# Altium schematic sheet power-input.SchDoc
size A4; SheetNumber: 2
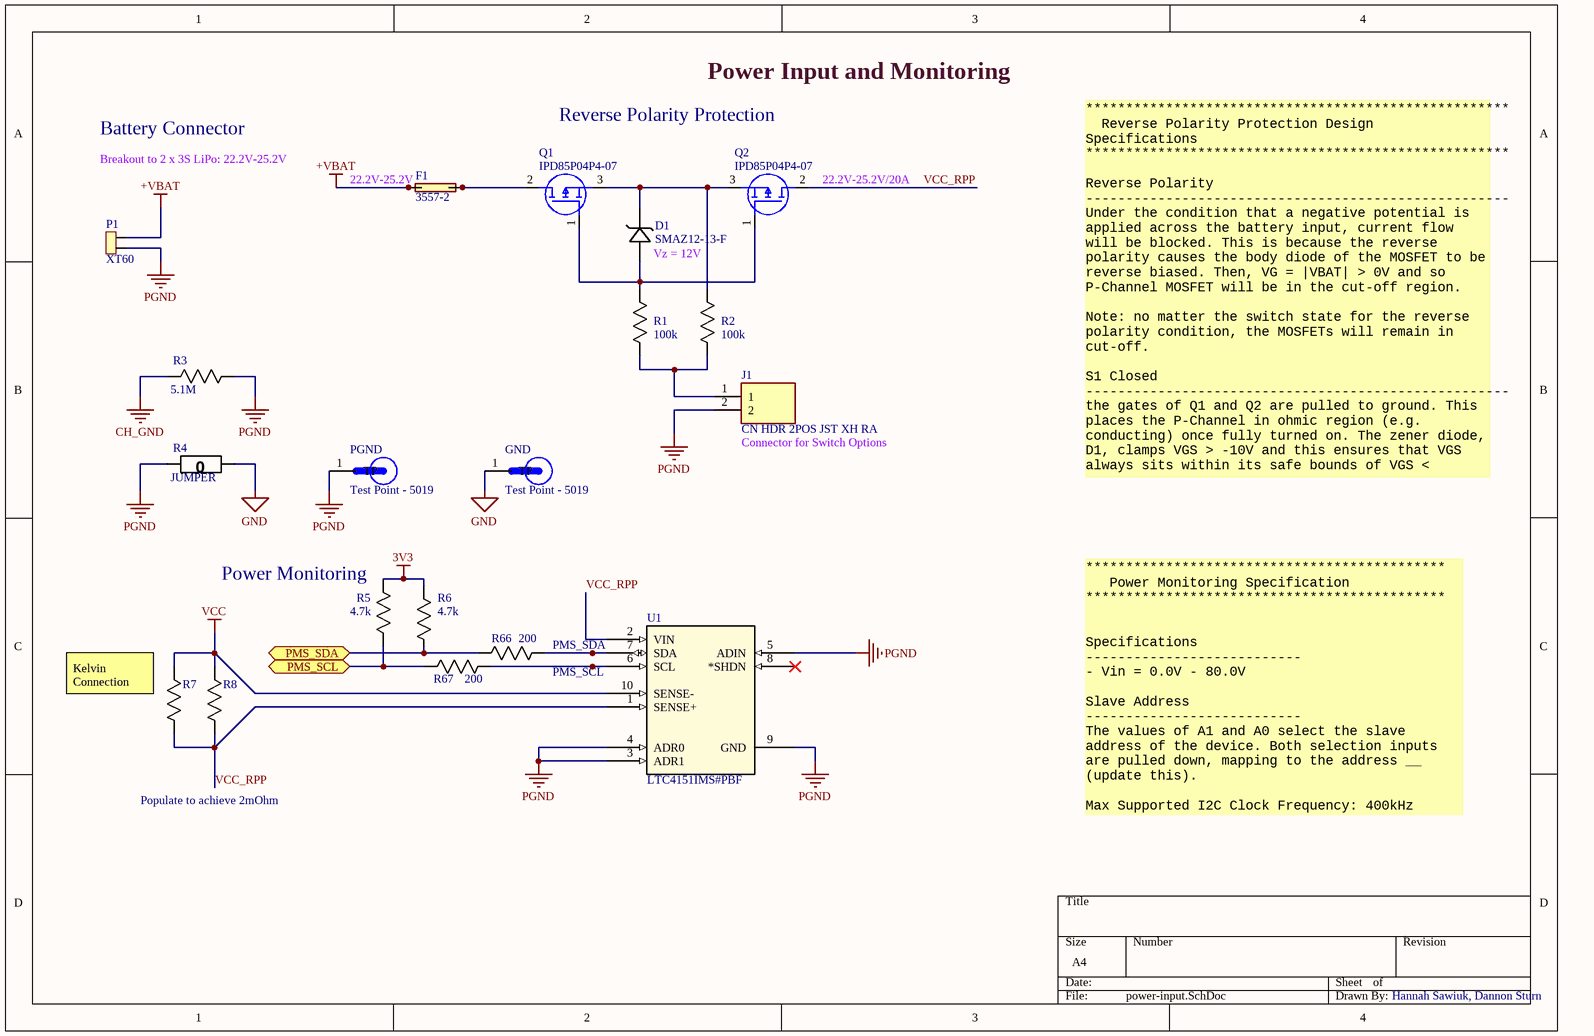
[diagram p0: power-input.SchDoc]

## Parts
D1  SMAZ12-13-F  [SMA_DIO-L]
F1  3557-2  [FUSE-3549-2]
GND  Test Point - 5019  [TP380X203]
J1  CN HDR 2POS JST XH RA  [JST_S2B-XH-A(LF)(SN)]
P1  XT60  [Amass_XT60PW-M]
PGND  Test Point - 5019  [TP380X203]
PMS_SCL  Test Point (Via)  [TP]  (value not drawn)  (no BOM)
PMS_SDA  Test Point (Via)  [TP]  (value not drawn)  (no BOM)
Q1  IPD85P04P4-07  [DPAK (TO-252)]
Q2  IPD85P04P4-07  [DPAK (TO-252)]
R1  100k  [0603]
R2  100k  [0603]
R3  5.1M  [0603]
R4  JUMPER  [1210]
R5  4.7k  [0603]
R6  4.7k  [0603]
R7  2mOHM  [2512]  (value not drawn)
R8  2mOHM  [2512]  (value not drawn)
R66  200  [0603]
R67  200  [0603]
U1  LTC4151IMS#PBF  [MSOP-10_MS_LIT]

## Ports
PMS_SCL (bidir), PMS_SDA (bidir)

## Nets
3V3: R5.2(R2) R6.2(R2)
+VBAT: F1.3(2A) F1.4(2B) P1.2
CH_GND: R3.2(R2)
GND: GND.1(TP) R4.1(R1)
PGND: J1.2 P1.1 PGND.1(TP) R3.1(R1) R4.2(R2) U1.3(ADR1) U1.4(ADR0) U1.5(ADIN) U1.9(GND)
VCC: R7.1(R1) R8.1(R1) U1.10(SENSE-)
PMS_SCL: R5.1(R1) R67.2(R2) ; port PMS_SCL
PMS_SDA: R6.1(R1) R66.2(R2) ; port PMS_SDA
VCC_RPP: Q2.2(D) R7.2(R2) R8.2(R2) U1.1(SENSE+) U1.2(VIN)
NetD1_1: D1.1 Q1.3(S) Q2.3(S) R2.1(R1)
NetD1_2: D1.2 Q1.1(G) Q2.1(G) R1.1(R1)
NetF1_1: F1.1(1A) F1.2(1B) Q1.2(D)
NetJ1_1: J1.1 R1.2(R2) R2.2(R2)
NetPMS_SCL_1: PMS_SCL.1 R67.1(R1) U1.6(SCL)
NetPMS_SDA_1: PMS_SDA.1 R66.1(R1) U1.7(SDA)

Not connected (* = marked no-connect by the designer): U1 8(*SHDN)*

## Notes on the sheet
- Power Input and Monitoring
- Battery Connector
- Breakout to 2 x 3S LiPo: 22.2V-25.2V
- Reverse Polarity Protection
- (near F1) 22.2V-25.2V
- (near Q2) 22.2V-25.2V/20A
- (near D1) Vz = 12V
- (near J1) Connector for Switch Options
- *****************************************************
  Reverse Polarity Protection Design Specifications
  *****************************************************
  Reverse Polarity
  -----------------------------------------------------
  Under the condition that a negative potential is applied across the battery input, current flow will be blocked. This is because the reverse polarity causes the body diode of the MOSFET to be reverse biased. Then, VG = |VBAT| > 0V and so P-Channel MOSFET will be in the cut-off region.
  Note: no matter the switch state for the reverse polarity condition, the MOSFETs will remain in cut-off.
  S1 Closed
  -----------------------------------------------------
  the gates of Q1 and Q2 are pulled to ground. This places the P-Channel in ohmic region (e.g. conducting) once fully turned on. The zener diode, D1, clamps VGS > -10V and this ensures that VGS always sits within its safe bounds of VGS < +5/-16V.
- (near R5) Power Monitoring
- (near R7) Kelvin Connection
- Populate to achieve 2mOhm
- *********************************************
  Power Monitoring Specification
  *********************************************
  Specifications
  ---------------------------
  - Vin = 0.0V - 80.0V
  Slave Address
  ---------------------------
  The values of A1 and A0 select the slave address of the device. Both selection inputs are pulled down, mapping to the address __ (update this).
  Max Supported I2C Clock Frequency: 400kHz
- Hannah Sawiuk, Dannon Sturn

## Library data of the parts
D1 = DIODE ZENER 12V 1W: Zener Diode 12 V 1 W ±5% Surface Mount SMA; Mfr_Name: Diodes Inc; Type: DEV; Copyright: Copyright (C) 2021 Ultra Librarian. All rights reserved.; Manufacturer_Part_Number: SMAZ12-13-F; Digi-Key_Part_Number_1: SMAZ12-FDICT-ND; Digi-Key_Part_Number_2: SMAZ12-FDIDKR-ND; Digi-Key_Part_Number_3: SMAZ12-FDITR-ND; RefDes: RefDes; Supplier 1: Digi-Key; Supplier 2: Newark; Supplier 3: Digi-Key; Supplier Part Number 1: SMAZ12-FDICT-ND; Supplier Part Number 2: 23T8541; Supplier Part Number 3: SMAZ12-FDICT-ND; Part Number: DIODE ZENER 12V 1W; Manufacturer Part Number 1: SMAZ12-13-F; Supplier URL 1: https://www.digikey.com/en/products/detail/SMAZ12-13-F/SMAZ12-FDICT-ND/725073?curr=usd&utm_campaign=buynow&utm_medium=aggregator&utm_source=octopart
F1 = FUSE BLADE: Fuse Block 30A 500V 1 Circuit Blade Through Hole; MF: Keystone Electronics; Package: Nonstandard Keystone; Value: *; Price: None; MP: 3557-2; SnapEDA_Link: https://www.snapeda.com/parts/3557-2/Keystone%20Electronics/view-part/278060/?ref=snap; Supplier 1: Digi-Key; Supplier Part Number 1: 36-3557-2-ND; Part Number: FUSE BLADE; Pin Count: 4
GND PGND = Test Point - 5019: PC Test Point, Miniature Phosphor Bronze, Silver Plating Surface Mount Mounting Type; MP: 5019; MF: Keystone Electronics; Value: *; Package: 2010 Keystone; Part Number: Test Point - 5019
J1 = CN HDR 2POS JST XH RA: Connector Header Through Hole 2 position right angle 0.098 _2.50mm_ / JST XH; MP: B2B-XH-A_LF__SN_; MF: JST Sales; Price: None; Package: None; Value: *; SnapEDA_Link: https://www.snapeda.com/parts/B2B-XH-A%28LF%29%28SN%29/JST%20Sales%20America%20Inc./view-part/492310/?ref=snap; Part Number: CN HDR 2POS JST XH RA; Pin Count: 2
P1 = XT60 Connector: XT60 CONNECTORS FEMALE PAIR; MF: SparkFun Electronics; MP: PRT-10474; Digikey: 1568-1816-ND; Digikey Link: https://www.digikey.ca/product-detail/en/sparkfun-electronics/PRT-10474/1568-1816-ND/8258064; Package: XT60; Price: 2.13000 CAD; Value: N/A; Supplier 1: Digi-Key; Supplier Part Number 1: 1568-1816-ND; Part Number: XT60 Connector; Supplier URL 1: https://www.digikey.ca/product-detail/en/sparkfun-electronics/PRT-10474/1568-1816-ND/8258064; Pin Count: 2
Q1 Q2 = MOSFET IPD85P04P4-07: P-Channel 40 V 85A (Tc) 88W (Tc) Surface Mount PG-TO252-3-313; Supplier 1: Digi-Key; Supplier 2: Mouser; Supplier 3: Digi-Key; Supplier Part Number 1: 448-IPD85P04P407ATMA1CT-ND; Supplier Part Number 2: 726-IPD85P04P4-07; Supplier Part Number 3: 448-IPD85P04P407ATMA1CT-ND; Part Number: MOSFET IPD85P04P4-07; Supplier URL 1: https://www.digikey.ca/en/products/detail/infineon-technologies/IPD85P04P407ATMA1/5960266
R1 R2 = RES 100k 1/8W - 1%: RES SMD 100K OHM 1% 1/8W 0603; Manufacturer Part Number 1: ERJ-H3GJ104V; Power (Watts): 0.125W; Package: 0805; Value: 100k; Tolerance: 1%; Part Number: RES 100k 1/8W - 1%; Supplier 1: Digi-Key; Supplier Part Number 1: 10-ERJ-H3GJ104VCT-ND; Supplier URL 1: https://www.digikey.ca/en/products/detail/panasonic-electronic-components/ERJ-H3GJ104V/13877854?s=N4IgTCBcDaIIwAYC0BRASgKSQCQMwHENEAWANQGEAVJAOQBEQBdAXyA
R3 = RES 5.1M 1/8W-5%: RES SMD 5.1 MOHM 5% 1/8W 0603; Power (Watts): 0.125W; Package: 0805; Value: 5.1M; Tolerance: 5%; Part Number: RES 5.1M 1/8W-5%
R4 = RES 0 JUMPER: RES SMD 0 OHM JUMPER GENERIC 0603; Value: 0; Package: 0805; Part Number: RES 0 JUMPER; Tolerance: N/A
R5 R6 = RES 4.7k 1/8W - 5%: RES SMD 4.7k OHM 5% 1/8W 0603; Manufacturer Part Number 1: RMCF0603JT4K70; Power (Watts): 0.125W; Package: 0805; Value: 4.7k; Tolerance: 5%; Part Number: RES 4.7k 1/8W - 5%; Supplier 1: Digi-Key; Supplier Part Number 1: RMCF0603JT4K70CT-ND; Supplier URL 1: https://www.digikey.ca/en/products/detail/stackpole-electronics-inc/RMCF0603JT4K70/1757976
R7 R8 = RES 2m 1W: RES SMD 2m OHM 1% 1W 2512; Package: 1206; Power (Watts): 1W; Tolerance: 1%; Part Number: RES 2m 1W
R66 R67 = RES 200.0 1/8W: RES SMD 200 OHM 5% 1/8W 0603; Power (Watts): 0.125W; Package: 0603; Value: 200; Tolerance: 5%; Part Number: RES 200.0 1/8W
U1 = ltc4151ims#pbf: IC CURRENT MONITOR(12BIT) 10MSOP; Mfr_Name: Analog Devices / Linear Technology; Copyright: Copyright (C) 2021 Ultra Librarian. All rights reserved.; Manufacturer_Part_Number: ltc4151ims#pbf; Digi-Key_Part_Number_1: LTC4151IMS#PBF-ND; RefDes: RefDes; Type: DEV; Supplier 1: Digi-key; Supplier Part Number 1: LTC4151IMS#PBF-ND; Part Number: ltc4151ims#pbf; Manufacturer Part Number 1: ltc4151ims#pbf; Supplier URL 1: https://www.digikey.ca/en/products/detail/analog-devices-inc/LTC4151IMS-PBF/1814473?s=N4IgTCBcDaIDIBUDCAWAjAVjQSQLIGUBiABQCEAxEAXQF8g
PMS_SCL PMS_SDA = Test Point (Via): Part Number: Test Point (Via)